# EasyEDA Pro project slow-movie-player.eprj

# Schematic smp7c
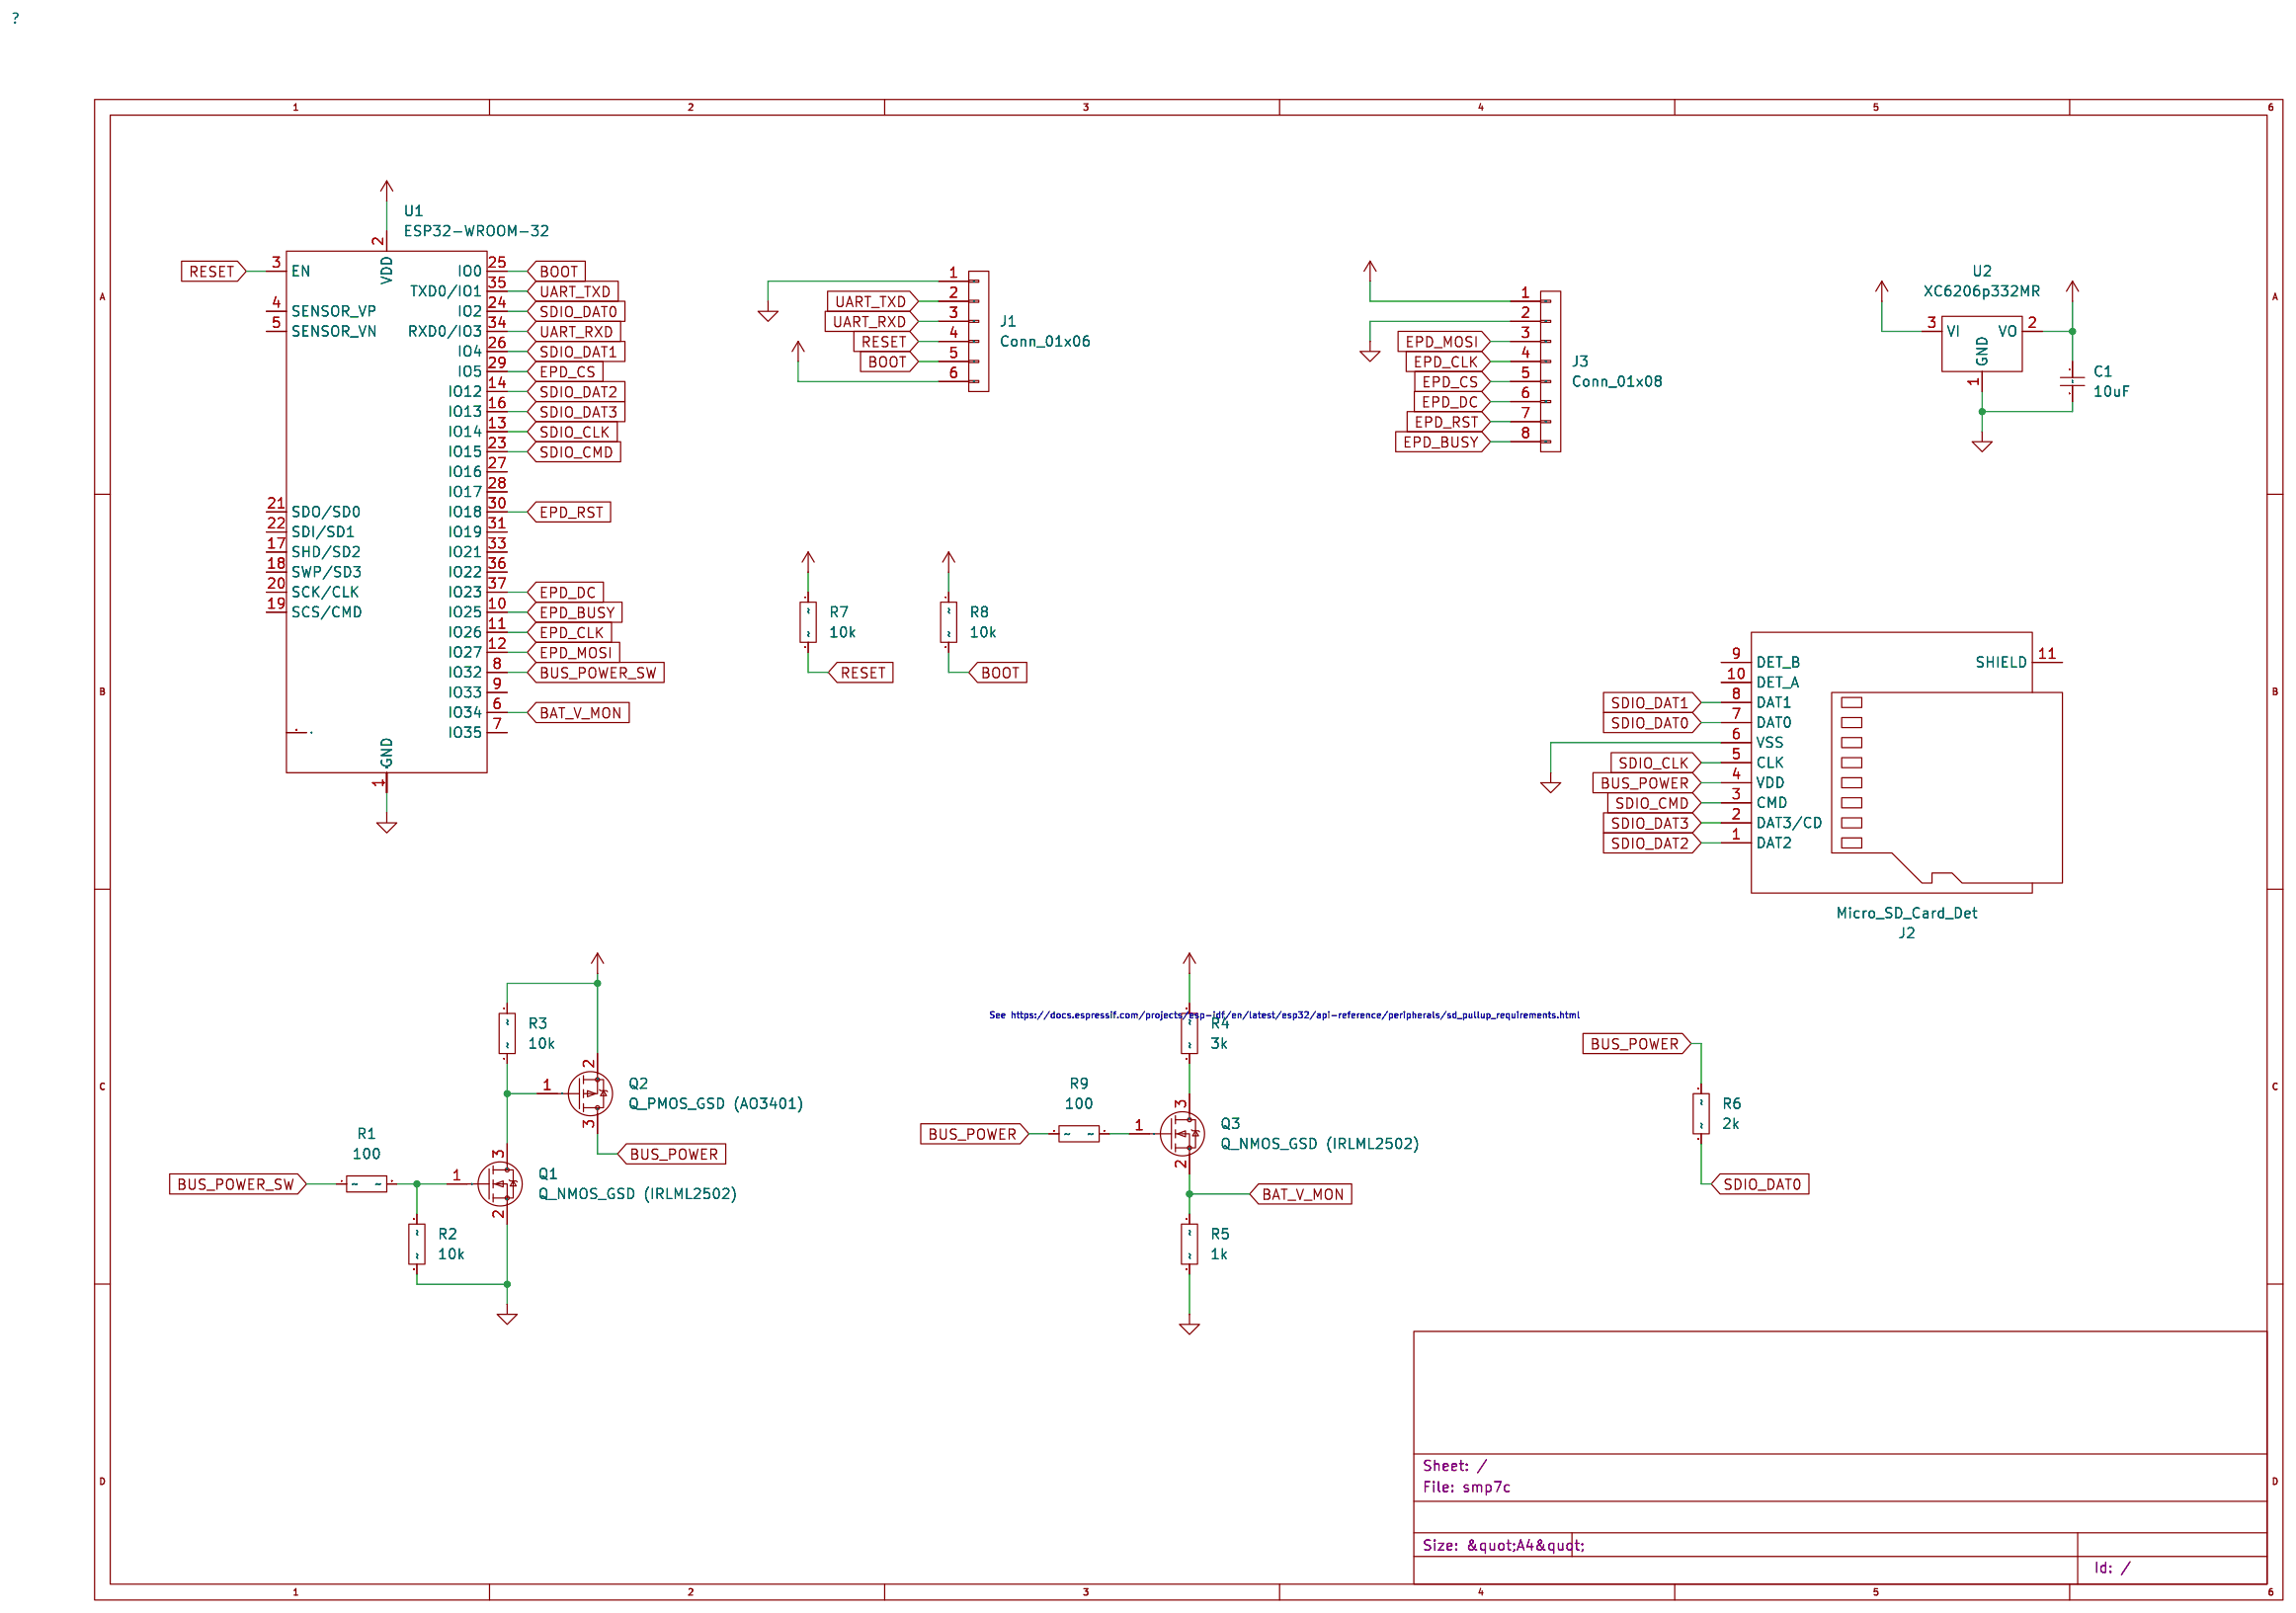
[diagram p0: schematic sheet]

## Parts
C1  10uF  [Capacitor_SMD:C_1206_3216Metric]
J1  Conn_01x06  [Connector_PinSocket_2.54mm:PinSocket_1x06_P2.54mm_Vertical]
J2  Micro_SD_Card_Det  [Connector_Card:microSD_HC_Hirose_DM3BT-DSF-PEJS]
J3  Conn_01x08  [Connector_PinSocket_2.54mm:PinSocket_1x08_P2.54mm_Vertical]
Q1  Q_NMOS_GSD (IRLML2502)  [Package_TO_SOT_SMD:SOT-23]
Q2  Q_PMOS_GSD (AO3401)  [Package_TO_SOT_SMD:SOT-23]
Q3  Q_NMOS_GSD (IRLML2502)  [Package_TO_SOT_SMD:SOT-23]
R1  100  [Resistor_SMD:R_0603_1608Metric]
R2  10k  [Resistor_SMD:R_0603_1608Metric]
R3  10k  [Resistor_SMD:R_0603_1608Metric]
R4  3k  [Resistor_SMD:R_0603_1608Metric]
R5  1k  [Resistor_SMD:R_0603_1608Metric]
R6  2k  [Resistor_SMD:R_0603_1608Metric]
R7  10k  [Resistor_SMD:R_0603_1608Metric]
R8  10k  [Resistor_SMD:R_0603_1608Metric]
R9  100  [Resistor_SMD:R_0603_1608Metric]
U1  ESP32-WROOM-32  [RF_Module:ESP32-WROOM-32]
U2  XC6206p332MR  [Package_TO_SOT_SMD:SOT-23]

## Library data of the parts
C1 = Device_C_Small
J1 = Connector_Generic_Conn_01x06
J2 = Connector_Micro_SD_Card_Det: User doc link: https://www.hirose.com/product/en/download_file/key_name/DM3/category/Catalog/doc_file_id/49662/?file_category_id=4&amp;item_id=195&amp;is_series=1
J3 = Connector_Generic_Conn_01x08
Q1 Q3 = Device_Q_NMOS_GSD
Q2 = Device_Q_PMOS_GSD
R1-R9 = Device_R
U1 = RF_Module_ESP32-WROOM-32: User doc link: https://www.espressif.com/sites/default/files/documentation/esp32-wroom-32_datasheet_en.pdf
U2 = Regulator_Linear_XC6206PxxxMR: User doc link: https://www.torexsemi.com/file/xc6206/XC6206.pdf

## Nets
BAT_V_MON: Q3.2(S) R5.1 U1.6(IO34)
BOOT: J1.5(Pin) R8.2 U1.25(IO0)
BUS_POWER: J2.4(VDD) Q2.3(D) R6.1 R9.1
BUS_POWER_SW: R1.1 U1.8(IO32)
EPD_BUSY: J3.8(Pin) U1.10(IO25)
EPD_CLK: J3.4(Pin) U1.11(IO26)
EPD_CS: J3.5(Pin) U1.29(IO5)
EPD_DC: J3.6(Pin) U1.37(IO23)
EPD_MOSI: J3.3(Pin) U1.12(IO27)
EPD_RST: J3.7(Pin) U1.30(IO18)
POWER_+3V3: C1.1 J1.6(Pin) J3.1(Pin) Q2.2(S) R3.1 R7.1 R8.1 U1.2(VDD) U2.2(VO)
POWER_+BATT: R4.1 U2.3(VI)
POWER_GND: C1.2 J1.1(Pin) J2.6(VSS) J3.2(Pin) Q1.2(S) R2.2 R5.2 U1.1(GND) U1.15(GND) U1.38(GND) U1.39(GND) U2.1(GND)
RESET: J1.4(Pin) R7.2 U1.3(EN)
SDIO_CLK: J2.5(CLK) U1.13(IO14)
SDIO_CMD: J2.3(CMD) U1.23(IO15)
SDIO_DAT0: J2.7(DAT0) R6.2 U1.24(IO2)
SDIO_DAT1: J2.8(DAT1) U1.26(IO4)
SDIO_DAT2: J2.1(DAT2) U1.14(IO12)
SDIO_DAT3: J2.2(DAT3/CD) U1.16(IO13)
UART_RXD: J1.3(Pin) U1.34(RXD0/IO3)
UART_TXD: J1.2(Pin) U1.35(TXD0/IO1)
NET-(Q1-PAD1): Q1.1(G) R1.2 R2.1
NET-(Q1-PAD3): Q1.3(D) Q2.1(G) R3.2
NET-(Q3-PAD1): Q3.1(G) R9.2
NET-(Q3-PAD3): Q3.3(D) R4.2

Not connected (* = marked no-connect by the designer): J2 9(DET_B) 10(DET_A) 11(SHIELD); U1 4(SENSOR_VP) 5(SENSOR_VN) 7(IO35) 9(IO33) 17(SHD/SD2) 18(SWP/SD3) 19(SCS/CMD) 20(SCK/CLK) 21(SDO/SD0) 22(SDI/SD1) 27(IO16) 28(IO17) 31(IO19) 32(NC) 33(IO21) 36(IO22)

## Notes on the sheet
- See https://docs.espressif.com/projects/esp-idf/en/latest/esp32/api-reference/peripherals/sd_pullup_requirements.html

# Board smp7c
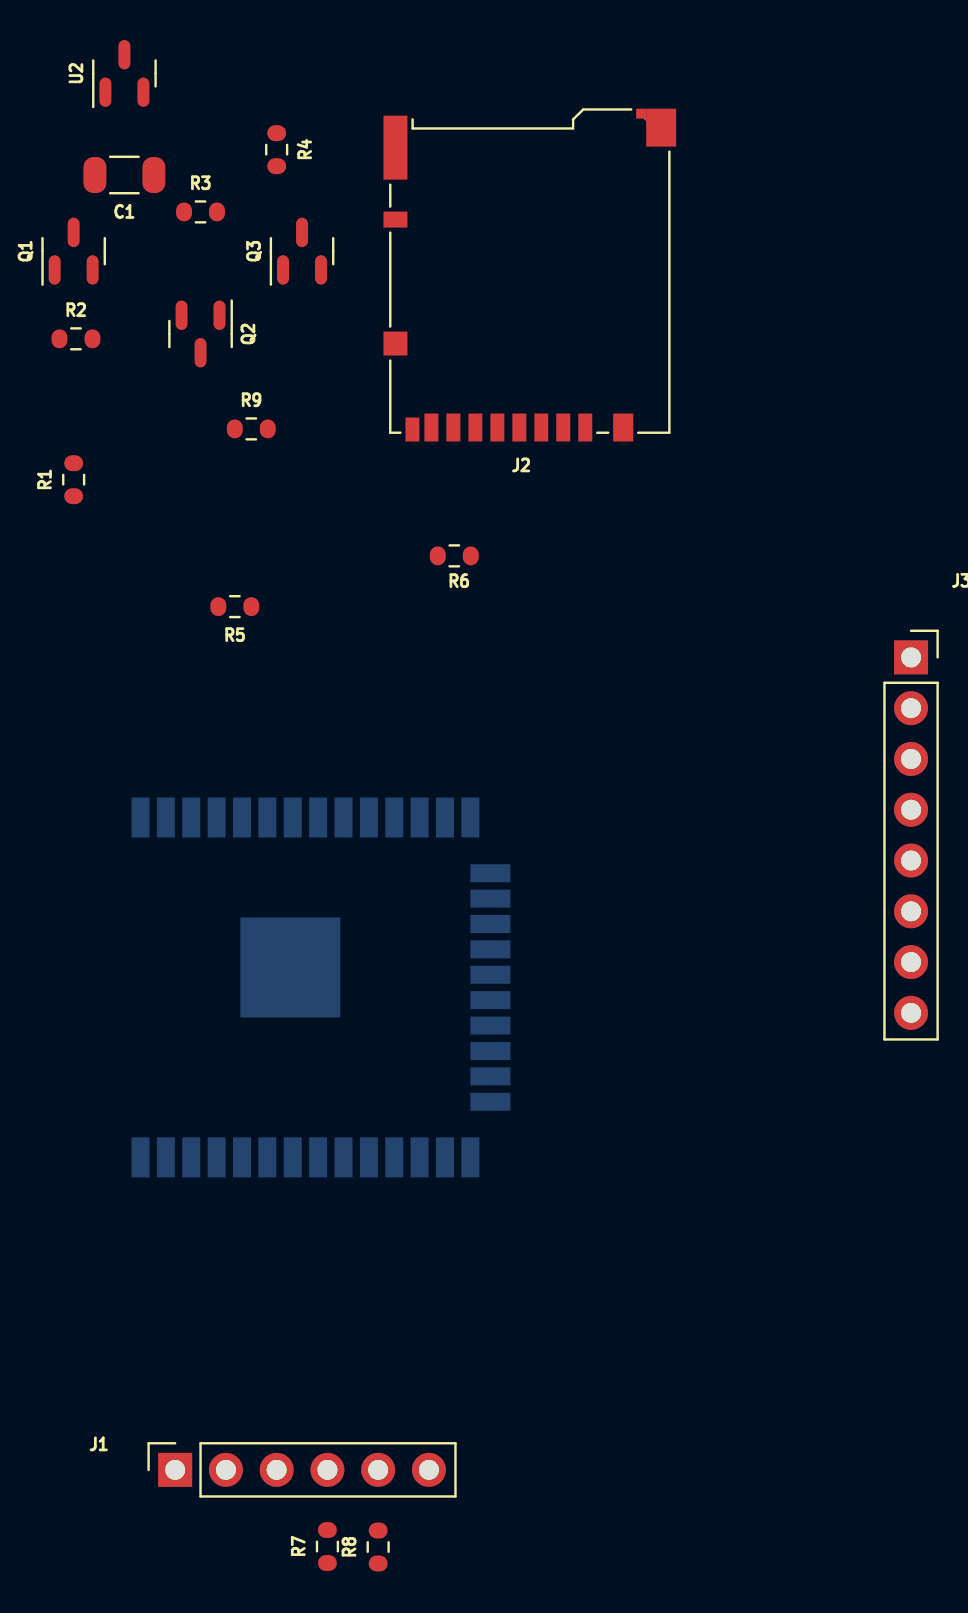
[diagram p1: board, top side]
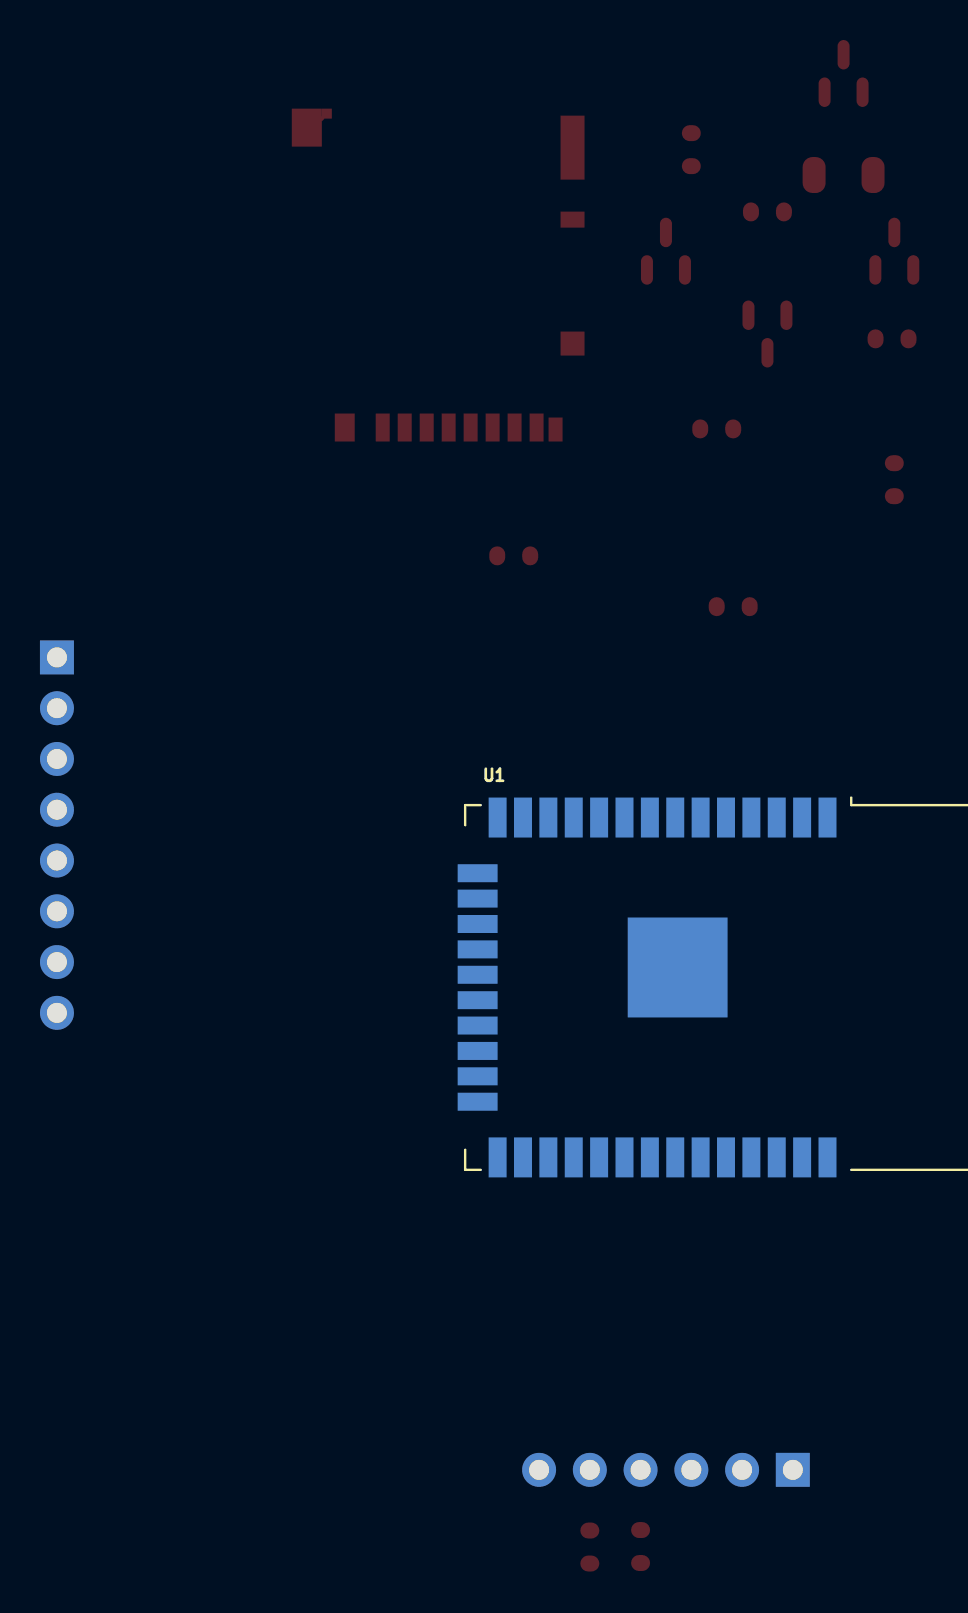
[diagram p2: board, bottom side, seen from below]

No outline. copper layers: Top Layer, Bottom Layer. Coordinates in mm from the lowest, leftmost part position.

## Placement (name value [footprint] x y rotation side)
C1  10uF  [Capacitor_SMD:C_1206_3216Metric]  2.54 68.63 180 top
J1  Conn_01x06  [Connector_PinSocket_2.54mm:PinSocket_1x06_P2.54mm_Vertical]  5.08 3.86 90 top
J2  Micro_SD_Card_Det  [Connector_Card:microSD_HC_Hirose_DM3BT-DSF-PEJS]  22.83 63.62 180 top
J3  Conn_01x08  [Connector_PinSocket_2.54mm:PinSocket_1x08_P2.54mm_Vertical]  41.91 44.5 0 top
Q1  Q_NMOS_GSD (IRLML2502)  [Package_TO_SOT_SMD:SOT-23]  0 64.82 90 top
Q2  Q_PMOS_GSD (AO3401)  [Package_TO_SOT_SMD:SOT-23]  6.35 60.68 270 top
Q3  Q_NMOS_GSD (IRLML2502)  [Package_TO_SOT_SMD:SOT-23]  11.43 64.82 90 top
R1  100  [Resistor_SMD:R_0603_1608Metric]  0 53.39 90 top
R2  10k  [Resistor_SMD:R_0603_1608Metric]  0.11 60.44 0 top
R3  10k  [Resistor_SMD:R_0603_1608Metric]  6.35 66.78 0 top
R4  3k  [Resistor_SMD:R_0603_1608Metric]  10.16 69.9 270 top
R5  1k  [Resistor_SMD:R_0603_1608Metric]  8.06 47.04 180 top
R6  2k  [Resistor_SMD:R_0603_1608Metric]  19.05 49.58 180 top
R7  10k  [Resistor_SMD:R_0603_1608Metric]  12.7 0.03 90 top
R8  10k  [Resistor_SMD:R_0603_1608Metric]  15.24 0 90 top
R9  100  [Resistor_SMD:R_0603_1608Metric]  8.89 55.93 0 top
U1  ESP32-WROOM-32  [RF_Module:ESP32-WROOM-32]  11.6 27.99 270 bottom
U2  XC6206p332MR  [Package_TO_SOT_SMD:SOT-23]  2.54 73.71 90 top

## Footprints (pads in the part's own frame, mm; a bottom-side part is the same pattern mirrored in y, then rotated)
Capacitor_SMD:C_1206_3216Metric
  rrect 1.15x1.8 smd: 1(-1.475,0) 2(1.475,0)
Connector_Card:microSD_HC_Hirose_DM3BT-DSF-PEJS
  rect 0.7x1.4 smd: 1(-2.775,7.625) 2(-1.675,7.625) 3(-0.575,7.625) 4(0.525,7.625) 5(1.625,7.625) 6(2.725,7.625) 7(3.825,7.625) 8(4.925,7.625)
  rect 0.7x1.2 smd: 9(5.875,7.725)
  rect 1.2x0.8 smd: 10(6.725,-2.775)
  rect 1.5x1.9 smd: 11(-6.575,-7.375)
  rect 0.2x0.2 smd rot 45: 11(-5.825,-7.825)
  rect 0.5x0.5 smd: 11(-5.575,-8.075)
  rect 1x1.4 smd: 11(-4.675,7.625)
  rect 1.2x1.2 smd: 11(6.725,3.425)
  rect 1.2x3.2 smd: 11(6.725,-6.375)
Connector_PinSocket_2.54mm:PinSocket_1x06_P2.54mm_Vertical
  rect 1.7x1.7 hole 1: 1(0,0)
  round 1.7 hole 1: 2(0,-2.54) 3(0,-5.08) 4(0,-7.62) 5(0,-10.16) 6(0,-12.7)
Connector_PinSocket_2.54mm:PinSocket_1x08_P2.54mm_Vertical
  rect 1.7x1.7 hole 1: 1(0,0)
  round 1.7 hole 1: 2(0,-2.54) 3(0,-5.08) 4(0,-7.62) 5(0,-10.16) 6(0,-12.7) 7(0,-15.24) 8(0,-17.78)
Package_TO_SOT_SMD:SOT-23
  rrect 1.475x0.6 smd: 1(-0.938,0.95) 2(-0.938,-0.95) 3(0.938,0)
Resistor_SMD:R_0603_1608Metric
  rrect 0.8x0.95 smd: 1(-0.825,0) 2(0.825,0)
RF_Module:ESP32-WROOM-32
  rect 2x0.9 smd: 1(-8.5,8.255) 2(-8.5,6.985) 3(-8.5,5.715) 4(-8.5,4.445) 5(-8.5,3.175) 6(-8.5,1.905) 7(-8.5,0.635) 8(-8.5,-0.635) 9(-8.5,-1.905) 10(-8.5,-3.175) 11(-8.5,-4.445) 12(-8.5,-5.715) 13(-8.5,-6.985) 14(-8.5,-8.255) 25(8.5,-8.255) 26(8.5,-6.985) 27(8.5,-5.715) 28(8.5,-4.445) 29(8.5,-3.175) 30(8.5,-1.905) 31(8.5,-0.635) 32(8.5,0.635) 33(8.5,1.905) 34(8.5,3.175) 35(8.5,4.445) 36(8.5,5.715) 37(8.5,6.985) 38(8.5,8.255)
  rect 0.9x2 smd: 15(-5.715,-9.255) 16(-4.445,-9.255) 17(-3.175,-9.255) 18(-1.905,-9.255) 19(-0.635,-9.255) 20(0.635,-9.255) 21(1.905,-9.255) 22(3.175,-9.255) 23(4.445,-9.255) 24(5.715,-9.255)
  rect 5x5 smd: 39(-1,0.755)

## Nets
As in the schematic, except:
+3V3: C1.1 J1.6 J3.1 Q2.2 R3.1 R7.1 R8.1 U1.2 U2.2
GND: C1.2 J1.1 J2.6 J3.2 Q1.2 R2.2 R5.2 U1.1 U1.15 U1.38 U1.39 U2.1
+BATT: R4.1 U2.3
